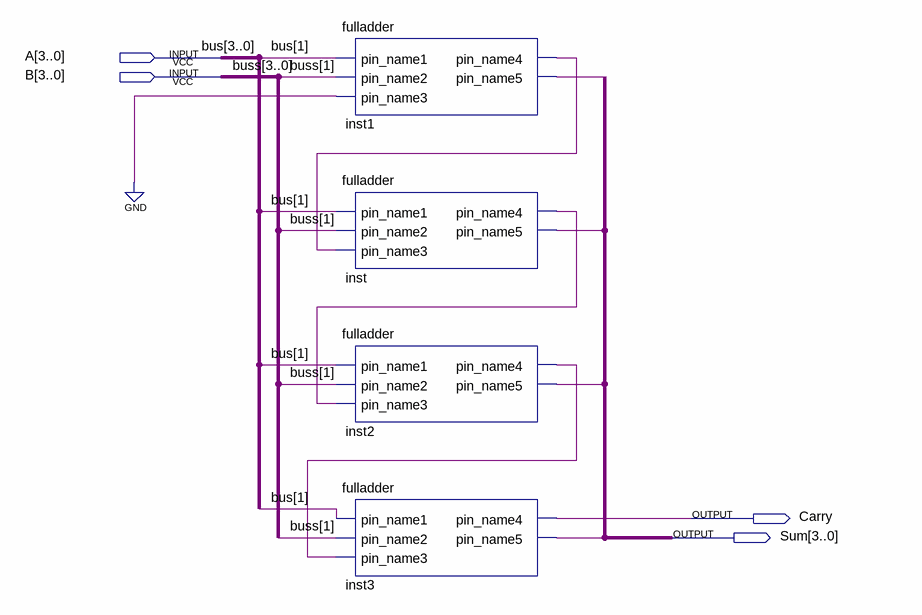
[diagram p0: schematic sheet]
// Quartus schematic adder4bit.bdf as structural Verilog: 4 symbols, 4 pins
module adder4bit (
  input  [3:0] A,
  input  [3:0] B,
  output Carry,
  output [3:0] Sum
);

  wire inst1_pin_name4, inst1_pin_name5, inst2_pin_name4, inst2_pin_name5, inst3_pin_name5, inst_pin_name4,
       inst_pin_name5;

  fulladder inst1 (
    .pin_name1(A[1]), .pin_name2(B[1]), .pin_name3(1'b0), .pin_name4(inst1_pin_name4),
    .pin_name5(inst1_pin_name5));
  fulladder inst (
    .pin_name1(A[1]), .pin_name2(B[1]), .pin_name3(inst1_pin_name4), .pin_name4(inst_pin_name4),
    .pin_name5(inst_pin_name5));
  fulladder inst2 (
    .pin_name1(A[1]), .pin_name2(B[1]), .pin_name3(inst_pin_name4), .pin_name4(inst2_pin_name4),
    .pin_name5(inst2_pin_name5));
  fulladder inst3 (
    .pin_name1(A[1]), .pin_name2(B[1]), .pin_name3(inst2_pin_name4), .pin_name4(Carry),
    .pin_name5(inst3_pin_name5));

  // Other names for the same wires on the sheet: bus[3:0] = A; buss[3:0] = B
endmodule
